# Altium schematic sheet CPU - power.SchDoc: CPU power
size A3; Author: Vi Tín; SheetNumber: 5; SheetTotal: 15
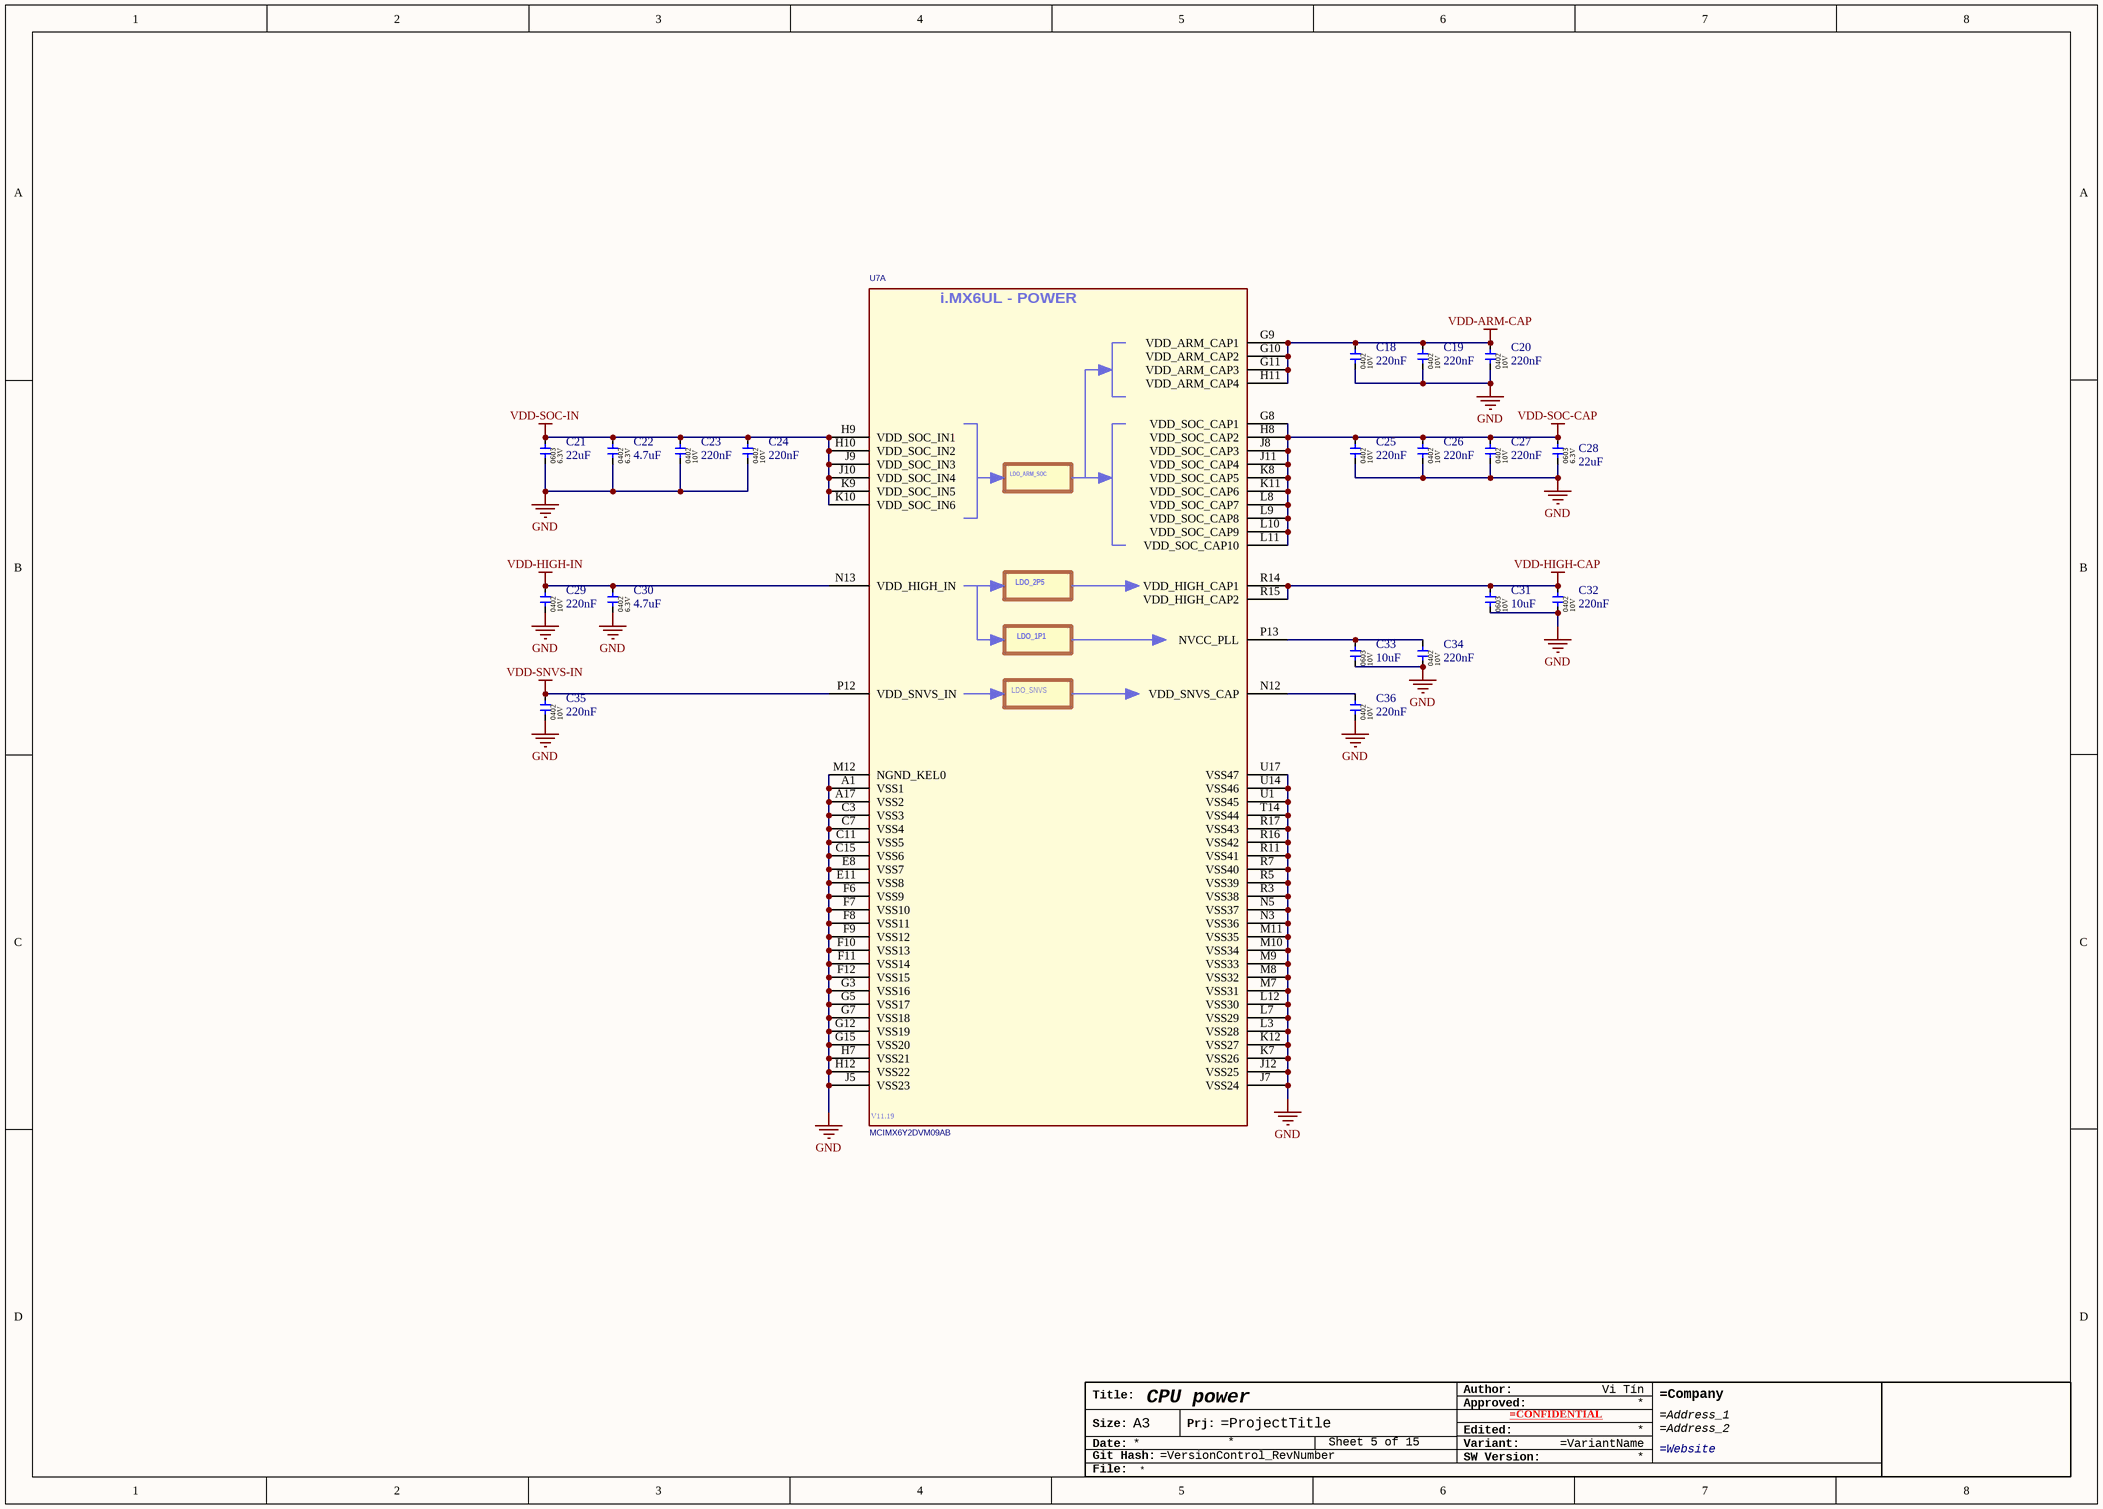
[diagram p0: CPU - power.SchDoc]

## Parts
*?  TitleBlock_Generic  (value not drawn)  (graphical)
C18  220nF  [CAP-0402]
C19  220nF  [CAP-0402]
C20  220nF  [CAP-0402]
C21  22uF  [CAP-0603]
C22  4.7uF  [CAP-0402]
C23  220nF  [CAP-0402]
C24  220nF  [CAP-0402]
C25  220nF  [CAP-0402]
C26  220nF  [CAP-0402]
C27  220nF  [CAP-0402]
C28  22uF  [CAP-0603]
C29  220nF  [CAP-0402]
C30  4.7uF  [CAP-0402]
C31  10uF  [CAP-0603]
C32  220nF  [CAP-0402]
C33  10uF  [CAP-0603]
C34  220nF  [CAP-0402]
C35  220nF  [CAP-0402]
C36  220nF  [CAP-0402]
U7  MCIMX6Y2DVM09AB  [IMX6ULL]  (part A of 11)

## Nets
GND: C18.1 C19.1 C20.1 C21.1 C22.1 C23.1 C24.1 C25.1 C26.1 C27.1 C28.1 C29.1 C30.1 C31.1 C32.1 C33.1 C34.1 C35.1 C36.1 U7.A1(VSS1) U7.A17(VSS2) U7.C3(VSS3) U7.C7(VSS4) U7.C11(VSS5) U7.C15(VSS6) U7.E8(VSS7) U7.E11(VSS8) U7.F6(VSS9) U7.F7(VSS10) U7.F8(VSS11) U7.F9(VSS12) U7.F10(VSS13) U7.F11(VSS14) U7.F12(VSS15) U7.G3(VSS16) U7.G5(VSS17) U7.G7(VSS18) U7.G12(VSS19) U7.G15(VSS20) U7.H7(VSS21) U7.H12(VSS22) U7.J5(VSS23) U7.J7(VSS24) U7.J12(VSS25) U7.K7(VSS26) U7.K12(VSS27) U7.L3(VSS28) U7.L7(VSS29) U7.L12(VSS30) U7.M7(VSS31) U7.M8(VSS32) U7.M9(VSS33) U7.M10(VSS34) U7.M11(VSS35) U7.M12(NGND_KEL0) U7.N3(VSS36) U7.N5(VSS37) U7.R3(VSS38) U7.R5(VSS39) U7.R7(VSS40) U7.R11(VSS41) U7.R16(VSS42) U7.R17(VSS43) U7.T14(VSS44) U7.U1(VSS45) U7.U14(VSS46) U7.U17(VSS47)
VDD-ARM-CAP: C18.2 C19.2 C20.2 U7.G9(VDD_ARM_CAP1) U7.G10(VDD_ARM_CAP2) U7.G11(VDD_ARM_CAP3) U7.H11(VDD_ARM_CAP4)
VDD-HIGH-CAP: C31.2 C32.2 U7.R14(VDD_HIGH_CAP1) U7.R15(VDD_HIGH_CAP2)
VDD-HIGH-IN: C29.2 C30.2 U7.N13(VDD_HIGH_IN)
VDD-SNVS-IN: C35.2 U7.P12(VDD_SNVS_IN)
VDD-SOC-CAP: C25.2 C26.2 C27.2 C28.2 U7.G8(VDD_SOC_CAP1) U7.H8(VDD_SOC_CAP2) U7.J8(VDD_SOC_CAP3) U7.J11(VDD_SOC_CAP4) U7.K8(VDD_SOC_CAP5) U7.K11(VDD_SOC_CAP6) U7.L8(VDD_SOC_CAP7) U7.L9(VDD_SOC_CAP8) U7.L10(VDD_SOC_CAP9) U7.L11(VDD_SOC_CAP10)
VDD-SOC-IN: C21.2 C22.2 C23.2 C24.2 U7.H9(VDD_SOC_IN1) U7.H10(VDD_SOC_IN2) U7.J9(VDD_SOC_IN3) U7.J10(VDD_SOC_IN4) U7.K9(VDD_SOC_IN5) U7.K10(VDD_SOC_IN6)
NetC33_2: C33.2 C34.2 U7.P13(NVCC_PLL)
NetC36_2: C36.2 U7.N12(VDD_SNVS_CAP)

## Notes on the sheet
- (in symbol MCIMX6Y2DVM09AB, part A) i.MX6UL - POWER; LDO_ARM_SOC; LDO_2P5; LDO_1P1; LDO_SNVS; V11.19
- (in symbol TitleBlock_Generic) Author:; Title:; Approved:; Size:; A3; Prj:; Edited:; Date:; Variant:; SW Version:; Git Hash:; File:

## Library data of the parts
C18-C20 C23-C27 C29 C32 C34-C36 = 0402X224J100CT: 220nF ±5% 10V X5R 0402 Multilayer Ceramic Capacitors MLCC - SMD/SMT RoHS; Manufacture: WALSIN; Package / Case: 0402; Component type: Capacitor; Manufacture part: 0402X224J100CT; Capacitor value: 220nF; Voltage: 10V; Package: 0402
C21 C28 = 0603X226M6R3CT: 22uF ±20% 6.3V X5R 0603 Multilayer Ceramic Capacitors MLCC - SMD/SMT RoHS; Manufacture: WALSIN; Package / Case: 0402; Component type: Capacitor; Manufacture part: 0603X226M6R3CT; Capacitor value: 22uF; Voltage: 6.3V; Package: 0603
C22 C30 = 0402X475M6R3CT: 4.7uF ±20% 6.3V X5R 0402 Multilayer Ceramic Capacitors MLCC - SMD/SMT RoHS; Manufacture: WALSIN; Package / Case: 0402; Component type: Capacitor; Manufacture part: 0402X475M6R3CT; Capacitor value: 4.7uF; Voltage: 6.3V; Package: 0402
C31 C33 = 0603X106M100CT: 10uF ±20% 10V X5R 0603 Multilayer Ceramic Capacitors MLCC - SMD/SMT RoHS; Manufacture: WALSIN; Package / Case: 0402; Component type: Capacitor; Manufacture part: 0603X106M100CT; Capacitor value: 10uF; Voltage: 10V; Package: 0603
U7 = MCIMX6Y2DVM09AB: Microprocessors - MPU i.MX 32-bit MPU ARM -A7 900MHz, 0.8mm Pitch; Manufacture: NXP Semiconductors; CLASS: IC; CAD_APPROVED: Yes; PRE_APN: 330-76997; MFG_PN01: PCIMX6G3CVM05AA; MFG_NAME01: FREESCALE SEMICONDUCTOR; AGILE_PN: TMP-WF-23753; HEIGHT: 1.37 MM; ROHS: Yes; Manufacture part: MCIMX6Y2DVM09AB; Package: MAPBGA-289 (14x14); Datasheet: https://www.mouser.vn/datasheet/2/302/IMX6ULLCEC-1126331.pdf
*? = TitleBlock_Generic: Manufacture part: TitleBlock_Generic; Manufacture: N/A; Type: Graphic